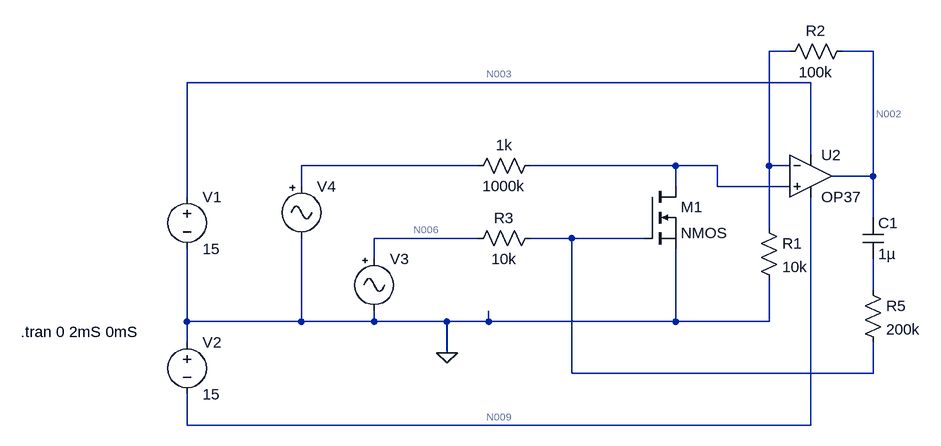
[diagram p0: schematic VCA.asc]
VCA.asc, the LTspice schematic file:
Version 4
SHEET 1 1140 680
WIRE 688 -96 656 -96
WIRE 816 -96 768 -96
WIRE 720 -48 -240 -48
WIRE 720 64 720 -48
WIRE 208 80 -64 80
WIRE 512 80 288 80
WIRE 576 80 512 80
WIRE 656 80 656 -96
WIRE 688 80 656 80
WIRE 816 96 816 -96
WIRE 816 96 752 96
WIRE -64 112 -64 80
WIRE 512 112 512 80
WIRE 576 112 576 80
WIRE 688 112 576 112
WIRE -240 128 -240 -48
WIRE 816 160 816 96
WIRE 656 176 656 80
WIRE 208 192 48 192
WIRE 352 192 288 192
WIRE 464 192 352 192
WIRE 48 224 48 192
WIRE 816 272 816 224
WIRE -240 320 -240 208
WIRE -64 320 -64 192
WIRE -64 320 -240 320
WIRE 48 320 48 304
WIRE 48 320 -64 320
WIRE 160 320 48 320
WIRE 224 320 224 304
WIRE 224 320 160 320
WIRE 512 320 512 208
WIRE 512 320 224 320
WIRE 656 320 656 256
WIRE 656 320 512 320
WIRE -240 352 -240 320
WIRE 160 368 160 320
WIRE 352 400 352 192
WIRE 816 400 816 352
WIRE 816 400 352 400
WIRE -240 480 -240 432
WIRE 720 480 720 128
WIRE 720 480 -240 480
FLAG 160 368 0
SYMBOL voltage -240 112 R0
WINDOW 123 0 0 Left 2
WINDOW 39 0 0 Left 2
SYMATTR InstName V1
SYMATTR Value 15
SYMBOL voltage -240 336 R0
WINDOW 123 0 0 Left 2
WINDOW 39 0 0 Left 2
SYMATTR InstName V2
SYMATTR Value 15
SYMBOL Opamps\\OP37 720 32 R0
SYMATTR InstName U2
SYMBOL res 784 -112 R90
WINDOW 0 0 56 VBottom 2
WINDOW 3 32 56 VTop 2
SYMATTR InstName R2
SYMATTR Value 100k
SYMBOL res 304 64 R90
WINDOW 0 0 56 VBottom 2
WINDOW 3 32 56 VTop 2
SYMATTR InstName 1k
SYMATTR Value 1000k
SYMBOL nmos 464 112 R0
SYMATTR InstName M1
SYMBOL Misc\\signal -64 96 R0
WINDOW 3 -84 -34 Invisible 2
WINDOW 123 0 0 Left 2
WINDOW 39 0 0 Left 2
SYMATTR InstName V4
SYMATTR Value SINE(0 0.040 150k)
SYMBOL Misc\\signal 48 208 R0
WINDOW 3 -84 134 Invisible 2
WINDOW 123 0 0 Left 2
WINDOW 39 0 0 Left 2
SYMATTR InstName V3
SYMATTR Value EXP(0 1 0 1uS 1uS 0.5mS)
SYMBOL res 304 176 R90
WINDOW 0 0 56 VBottom 2
WINDOW 3 32 56 VTop 2
SYMATTR InstName R3
SYMATTR Value 10k
SYMBOL res 640 160 R0
SYMATTR InstName R1
SYMATTR Value 10k
SYMBOL cap 800 160 R0
SYMATTR InstName C1
SYMATTR Value 1µ
SYMBOL res 800 256 R0
SYMATTR InstName R5
SYMATTR Value 200k
TEXT -496 336 Left 2 !.tran 0 2mS 0mS

The netlist it stands for:
* VCA.asc
V1 N003 0 15
V2 0 N009 15
XU2 N005 N001 N003 N009 N002 LT1037  ; OP37, pins In+ In- V+ V- OUT
R2 N002 N001 100k
R§1k N005 N004 1000k
M1 N005 N007 0 0 NMOS
V4 N004 0 SINE(0 0.040 150k)
V3 N006 0 EXP(0 1 0 1uS 1uS 0.5mS)
R3 N007 N006 10k
R1 N001 0 10k
C1 N002 N008 1µ
R5 N008 N007 200k
.model NMOS NMOS
.model PMOS PMOS
.lib standard.mos
.tran 0 2mS 0mS
.lib LTC.lib
.backanno
.end

* Results of the author's LTspice run, read from the files saved beside the schematic
* Operating Point, zero values left out:
*   V(n003) = 15 V
*   V(n009) = -15 V
*   I(V2) = -2.666 mA
*   I(V1) = -2.666 mA
*   Ix(u2:3) = 2.666 mA
*   Ix(u2:4) = -2.666 mA
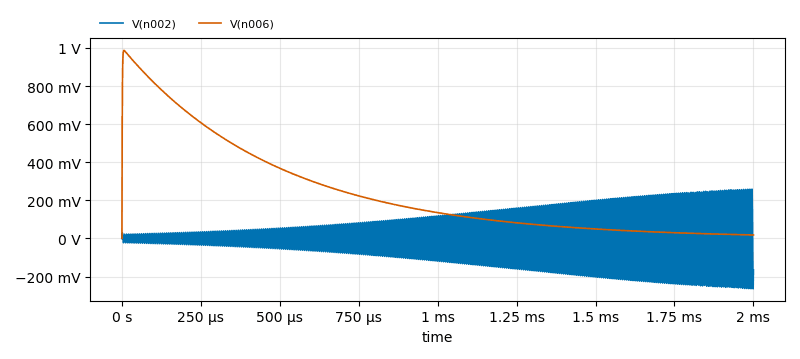
[diagram p1: Transient Analysis of VCA.asc, plotted from the saved traces]
* Transient Analysis, 1 run:
*   V(n002): min -264.2 mV, max 259.1 mV, average -380.3 µV, rms 106.7 mV, last -164.8 mV
*   V(n006): min 0 V, max 987.6 mV, average 245.4 mV, rms 353.1 mV, last 18.35 mV